# EAGLE schematic chip (EAGLE 5.91)
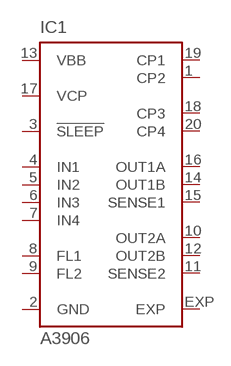
[diagram p0: schematic, sheet 1]

## Parts
IC1  A3906  [QFN20]
Unconnected: IC1.1(CP2) IC1.3(!SLEEP) IC1.4(IN1) IC1.5(IN2) IC1.6(IN3) IC1.7(IN4) IC1.8(FL1) IC1.9(FL2) IC1.10(OUT2A) IC1.11(SENSE2) IC1.12(OUT2B) IC1.14(OUT1B) IC1.15(SENSE1) IC1.16(OUT1A) IC1.17(VCP) IC1.18(CP3) IC1.19(CP1) IC1.20(CP4) IC1.EXP

## Power pins joined to a net without a drawn wire
GND: IC1.2(GND)
VBB: IC1.13(VBB)

## Library data of the parts
IC1 = allegro:A3906: Low Voltage Stepper and Single/Dual DC Motor Driver Data Sheet <http://www.allegromicro.com/en/Products/Part_Numbers/3906/3906.pdf>